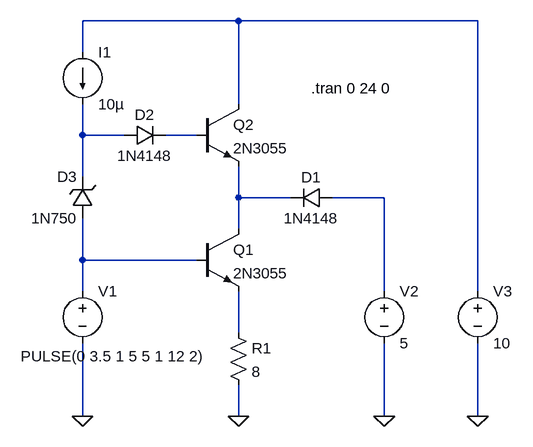
[diagram p0: schematic ClaseG_Basico.asc]
ClaseG_Basico.asc, the LTspice schematic file:
Version 4
SHEET 1 1020 680
WIRE 464 -48 224 -48
WIRE 832 -48 464 -48
WIRE 224 0 224 -48
WIRE 464 80 464 -48
WIRE 224 128 224 80
WIRE 288 128 224 128
WIRE 400 128 352 128
WIRE 224 192 224 128
WIRE 464 224 464 176
WIRE 544 224 464 224
WIRE 688 224 608 224
WIRE 464 272 464 224
WIRE 224 320 224 256
WIRE 400 320 224 320
WIRE 224 368 224 320
WIRE 688 368 688 224
WIRE 832 368 832 -48
WIRE 464 432 464 368
WIRE 224 560 224 448
WIRE 464 560 464 512
WIRE 688 560 688 448
WIRE 832 560 832 448
FLAG 464 560 0
FLAG 224 560 0
FLAG 688 560 0
FLAG 832 560 0
DATAFLAG 464 224 "$"
DATAFLAG 352 320 "$"
DATAFLAG 688 224 "$"
DATAFLAG 384 128 "$"
DATAFLAG 464 416 "$"
SYMBOL npn 400 272 R0
SYMATTR InstName Q1
SYMATTR Value 2N3055
SYMBOL npn 400 80 R0
SYMATTR InstName Q2
SYMATTR Value 2N3055
SYMBOL diode 608 208 R90
WINDOW 0 0 32 VBottom 2
WINDOW 3 32 32 VTop 2
SYMATTR InstName D1
SYMATTR Value 1N4148
SYMBOL diode 288 144 R270
WINDOW 0 32 32 VTop 2
WINDOW 3 0 32 VBottom 2
SYMATTR InstName D2
SYMATTR Value 1N4148
SYMBOL zener 240 256 R180
WINDOW 0 24 64 Left 2
WINDOW 3 24 0 Left 2
SYMATTR InstName D3
SYMATTR Value 1N750
SYMBOL voltage 224 352 R0
WINDOW 3 -95 116 Left 2
SYMATTR Value PULSE(0 3.5 1 5 5 1 12 2)
SYMATTR InstName V1
SYMBOL voltage 688 352 R0
SYMATTR InstName V2
SYMATTR Value 5
SYMBOL voltage 832 352 R0
SYMATTR InstName V3
SYMATTR Value 10
SYMBOL res 448 416 R0
SYMATTR InstName R1
SYMATTR Value 8
SYMBOL current 224 0 R0
SYMATTR InstName I1
SYMATTR Value 10µ
TEXT 576 56 Left 2 !.tran 0 24 0

The netlist it stands for:
* ClaseG_Basico.asc
Q1 N004 N006 N007 0 2N3055
Q2 N001 N003 N004 0 2N3055
D1 N005 N004 1N4148
D2 N002 N003 1N4148
D3 N006 N002 1N750
V1 N006 0 PULSE(0 3.5 1 5 5 1 12 2)
V2 N005 0 5
V3 N001 0 10
R1 N007 0 8
I1 N001 N002 10µ
.model D D
.lib standard.dio
.model NPN NPN
.model PNP PNP
.lib standard.bjt
.tran 0 24 0
.backanno
.end